# EAGLE design ItsyBitsy_Keybow_04 (EAGLE 9.5.2)
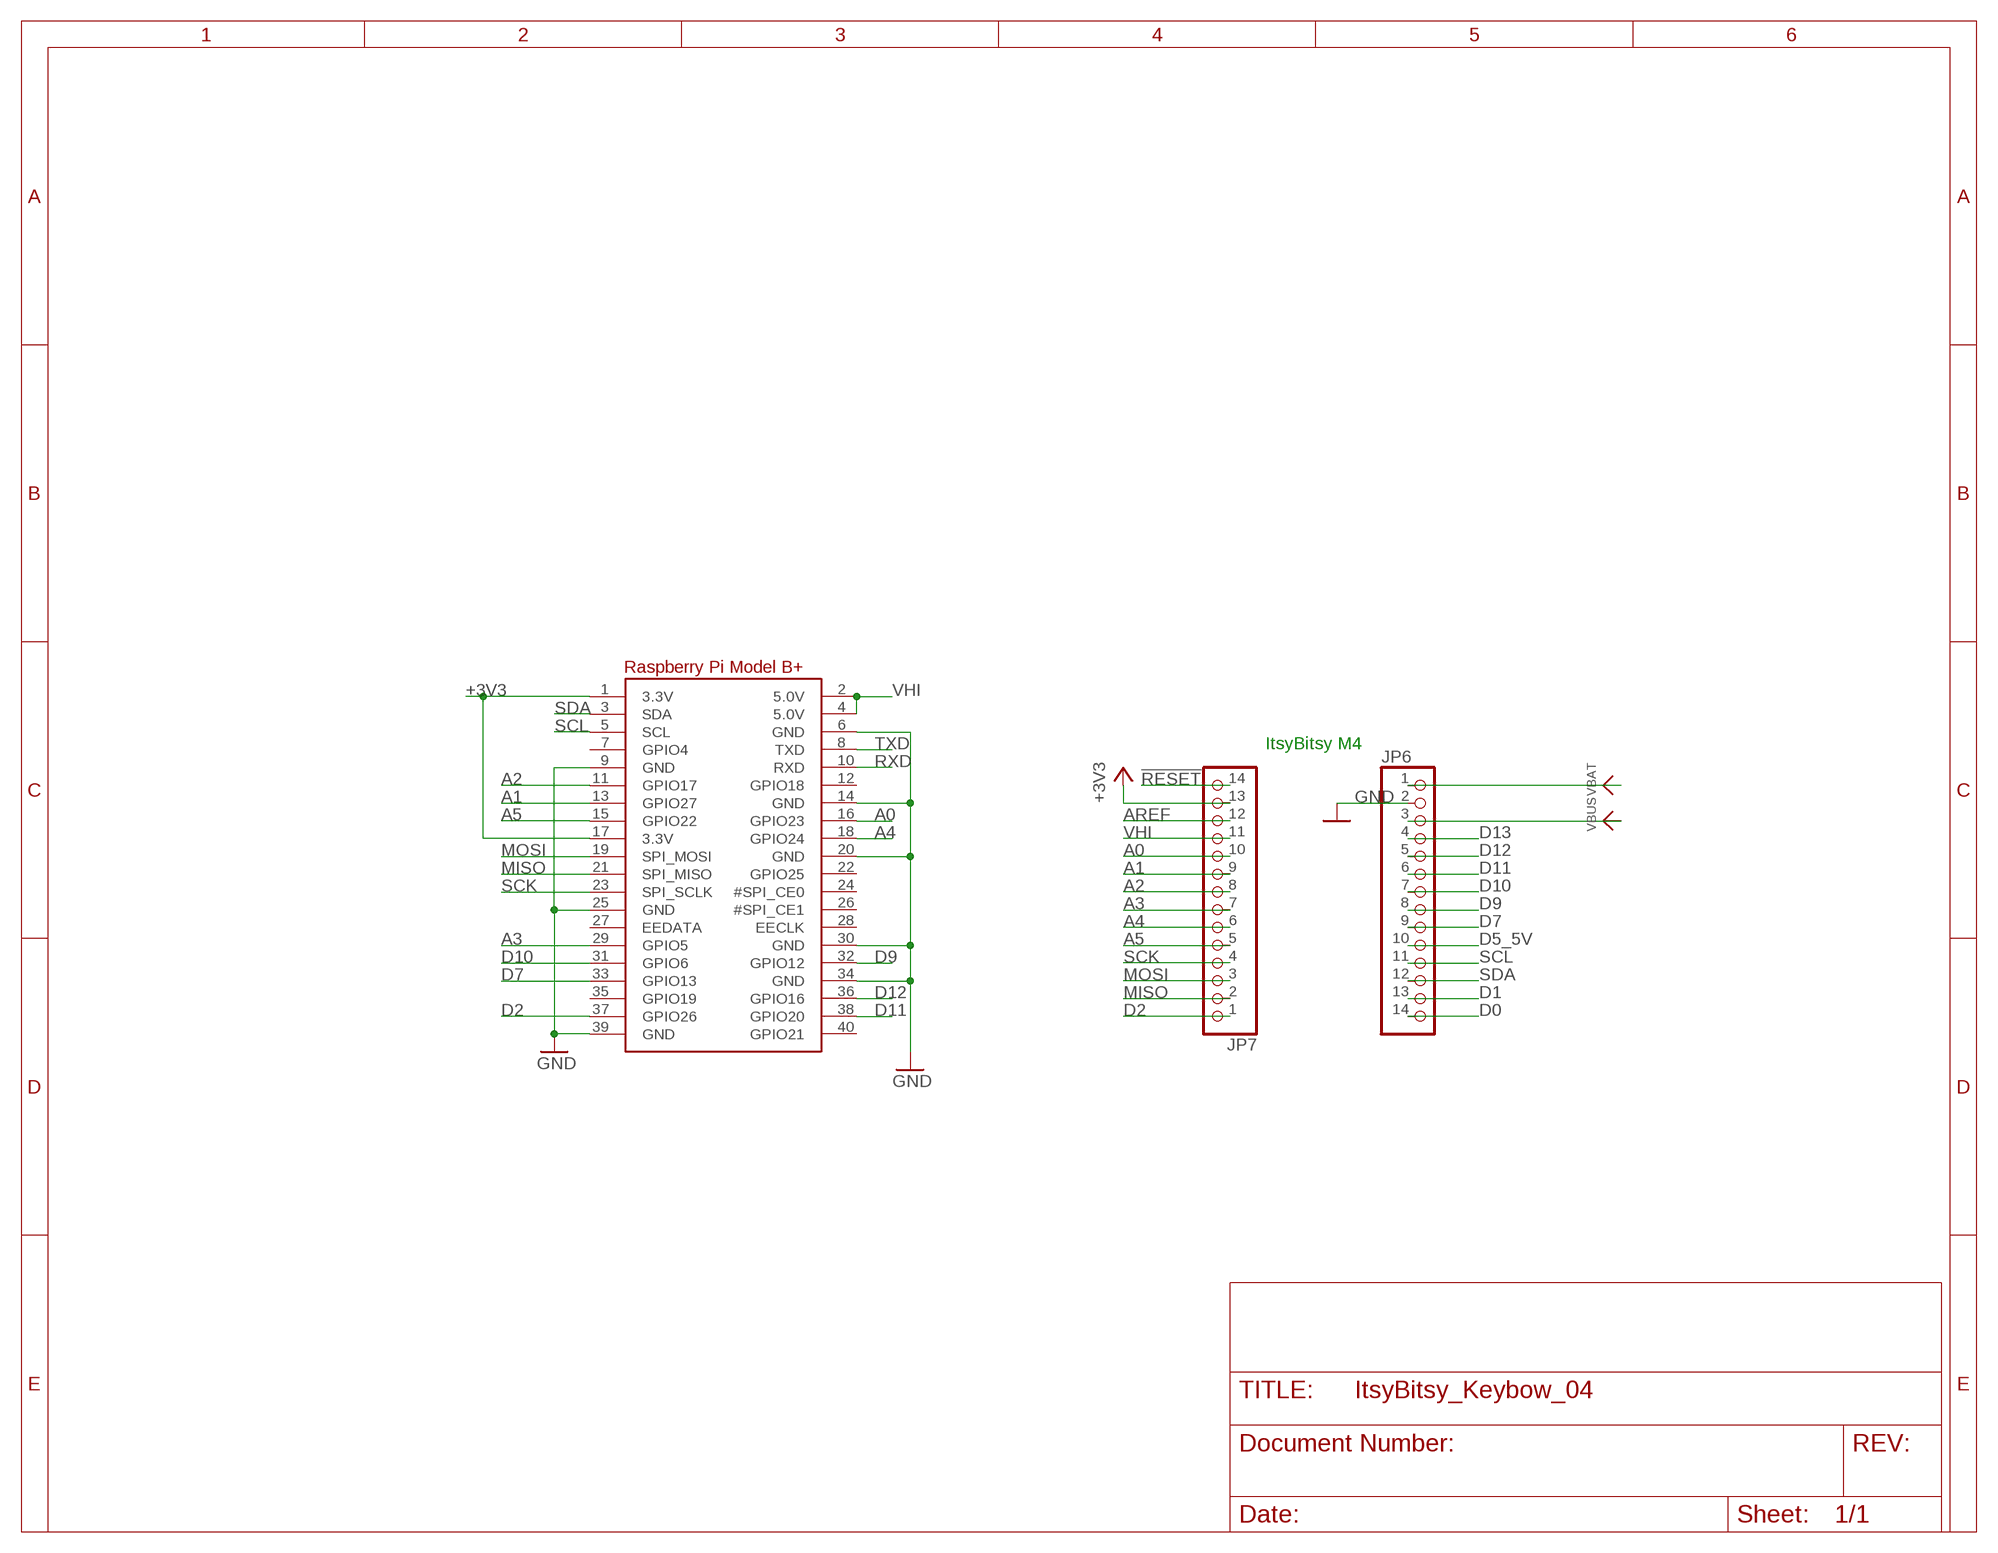
[diagram p0: schematic, sheet 1]

## Parts
JP6  HEADER-1X14  [1X14_ROUND70]
JP7  HEADER-1X14  [1X14_ROUND70]
RPI1  RASPBERRYPI_BPLUS_BONNETNODIM  [PI_BONNET_NODIM]

## Nets
!RESET: JP7.14
+3V3: JP7.13 RPI1.1(3.3V) RPI1.17(3.3V)
A0: JP7.10 RPI1.16(GPIO23)
A1: JP7.9 RPI1.13(GPIO27)
A2: JP7.8 RPI1.11(GPIO17)
A3: JP7.7 RPI1.29(GPIO5)
A4: JP7.6 RPI1.18(GPIO24)
A5: JP7.5 RPI1.15(GPIO22)
AREF: JP7.12
D0: JP6.14
D1: JP6.13
D2: JP7.1 RPI1.37(GPIO26)
D5_5V: JP6.10
D7: JP6.9 RPI1.33(GPIO13)
D9: JP6.8 RPI1.32(GPIO12)
D10: JP6.7 RPI1.31(GPIO6)
D11: JP6.6 RPI1.38(GPIO20)
D12: JP6.5 RPI1.36(GPIO16)
D13: JP6.4
GND: JP6.2 RPI1.6(GND) RPI1.9(GND) RPI1.14(GND) RPI1.20(GND) RPI1.25(GND) RPI1.30(GND) RPI1.34(GND) RPI1.39(GND)
MISO: JP7.2 RPI1.21(SPI_MISO)
MOSI: JP7.3 RPI1.19(SPI_MOSI)
RXD: RPI1.10(RXD)
SCK: JP7.4 RPI1.23(SPI_SCLK)
SCL: JP6.11 RPI1.5(SCL)
SDA: JP6.12 RPI1.3(SDA)
TXD: RPI1.8(TXD)
VBAT: JP6.1
VBUS: JP6.3
VHI: JP7.11 RPI1.2(5.0V) RPI1.4(5.0V)
Unconnected: RPI1.7(GPIO4) RPI1.12(GPIO18) RPI1.22(GPIO25) RPI1.24(#SPI_CE0) RPI1.26(#SPI_CE1) RPI1.27(EEDATA) RPI1.28(EECLK) RPI1.35(GPIO19) RPI1.40(GPIO21)

## Notes on the sheet
- ItsyBitsy M4

## Library data of the parts
JP6 JP7 = microbuilder:HEADER-1X14
RPI1 = microbuilder:RASPBERRYPI_BPLUS

## Board
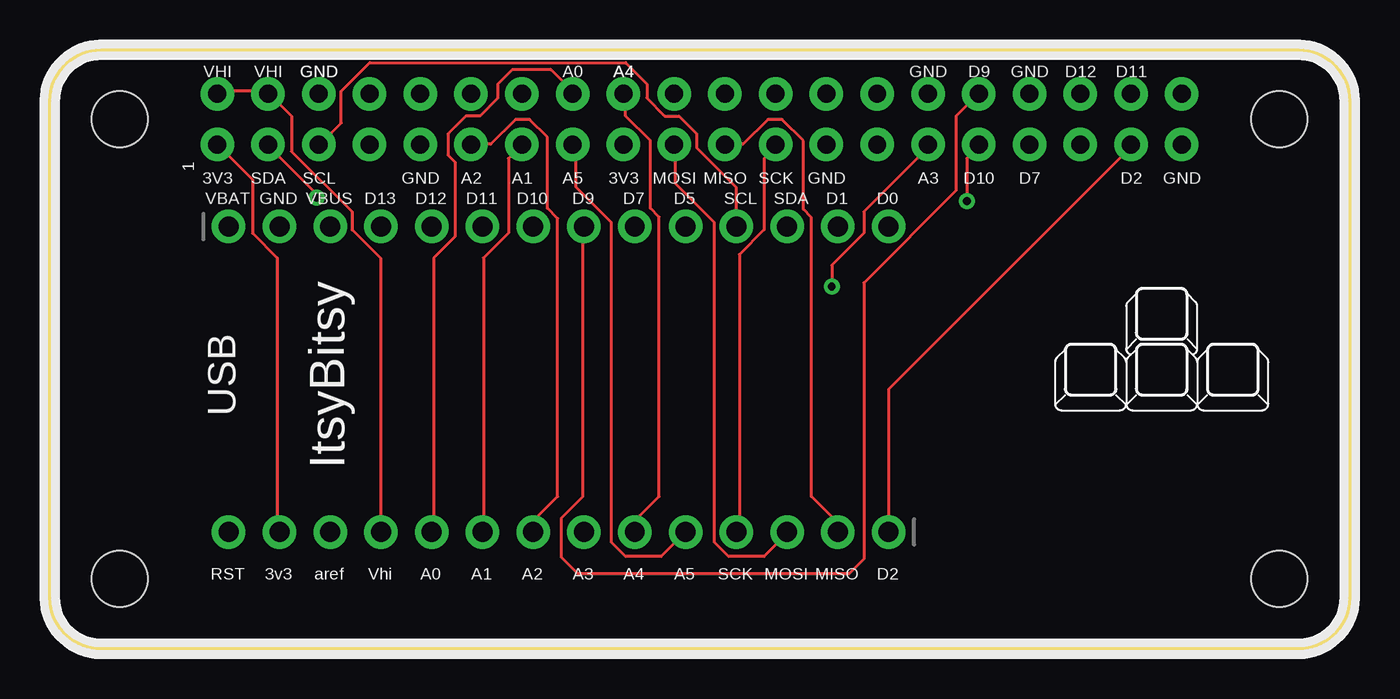
[diagram p1: board, top side]
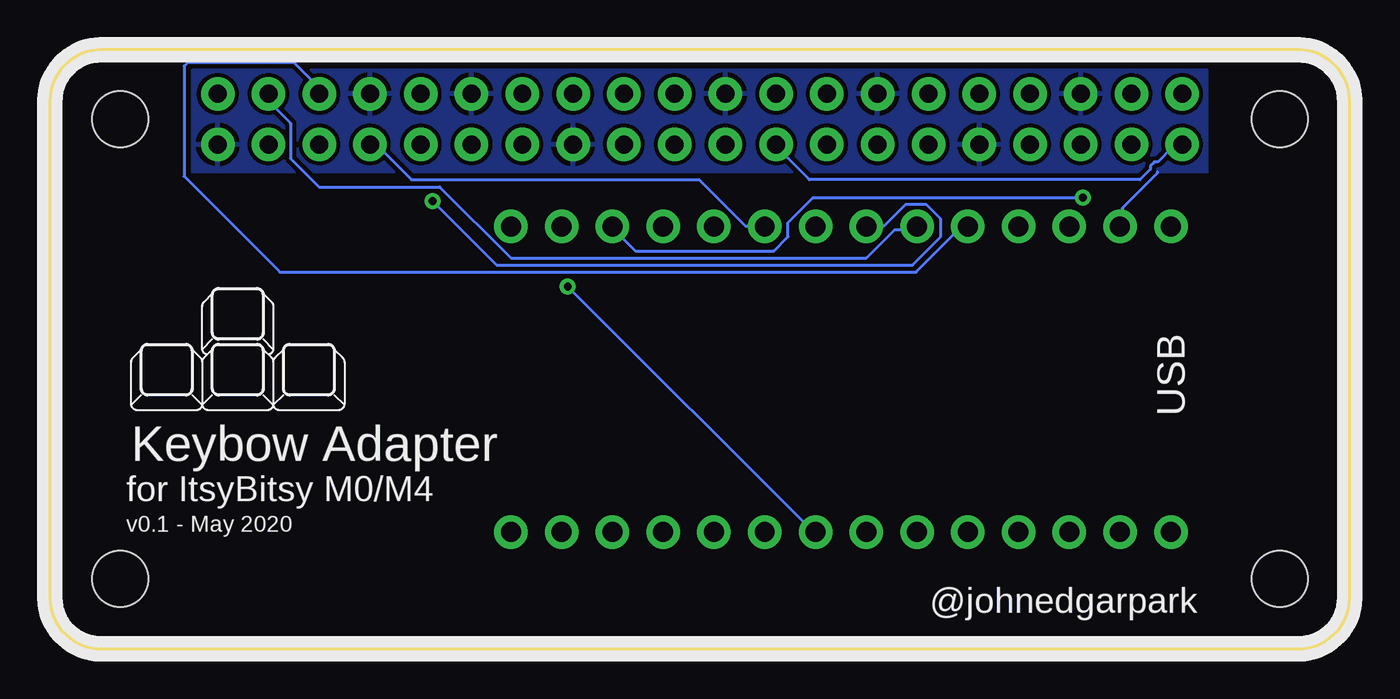
[diagram p2: board, bottom side, seen from below]

Size 65.02 x 29.97 mm. Coordinates in mm from the lower left corner, seen from the top.
Outline: 2.54,29.97 62.48,29.97 arc-90 65.02,27.43 65.02,2.54 arc-90 62.48,0 2.54,0 arc-90 0,2.54 0,27.43 arc-90 2.54,29.97
Copper layers (1*16): Top 0.035mm / dielectric 1.5mm / Bottom 0.035mm
Design rules "adafruit 7-7": minimum track width 6mil, minimum drill 15.5mil, track to track 8mil, track to pad 7mil, pad to pad 7mil, via to via 7mil, smd to smd 7mil, copper to edge 10mil, drill to drill 8mil, minimum pad ring 10mil, minimum via ring 8mil, stop-mask expansion 2mil, vias tented up to drill 20mil, thermal gap 10mil

### Footprints (pad centres in the part's own frame; a part is rotated, then mirrored left to right if it is on the bottom)
1X14_ROUND70 = drill 1 pad 1.676: 1 -16.51,0; 2 -13.97,0; 3 -11.43,0; 4 -8.89,0; 5 -6.35,0; 6 -3.81,0; 7 -1.27,0; 8 1.27,0; 9 3.81,0; 10 6.35,0; 11 8.89,0; 12 11.43,0; 13 13.97,0; 14 16.51,0
PI_BONNET_NODIM = drill 0.9 pad 1.676: 1 8.37,25.23; 2 8.37,27.77; 3 10.91,25.23; 4 10.91,27.77; 5 13.45,25.23; 6 13.45,27.77; 7 15.99,25.23; 8 15.99,27.77; 9 18.53,25.23; 10 18.53,27.77; 11 21.07,25.23; 12 21.07,27.77; 13 23.61,25.23; 14 23.61,27.77; 15 26.15,25.23; 16 26.15,27.77; 17 28.69,25.23; 18 28.69,27.77; 19 31.23,25.23; 20 31.23,27.77; 21 33.77,25.23; 22 33.77,27.77; 23 36.31,25.23; 24 36.31,27.77; 25 38.85,25.23; 26 38.85,27.77; 27 41.39,25.23; 28 41.39,27.77; 29 43.93,25.23; 30 43.93,27.77; 31 46.47,25.23; 32 46.47,27.77; 33 49.01,25.23; 34 49.01,27.77; 35 51.55,25.23; 36 51.55,27.77; 37 54.09,25.23; 38 54.09,27.77; 39 56.63,25.23; 40 56.63,27.77 | hole 2.8: 3.5,3.5; 3.5,26.5; 61.5,26.5; 61.5,3.5

### Placement (x,y rotation side)
JP6  25.45,21.13 0 top
JP7  25.45,5.84 180 top
RPI1  0,0.01 0 top

### Tracks (layer width: path | path; a pad name or v marks a point on that pad's centre or on a via)
+3V3
  Top 0.152: JP7.13 11.38,5.87 11.38,19.56 10.13,20.8 10.13,23.47 8.53,25.07 RPI1.1
  Bottom 0.152: RPI1.17 28.63,25.07 27.03,23.47 10.49,23.47 9.96,24 9.96,24.18 9.78,24.36 9.6,24.36 8.89,25.07 8.53,25.07 RPI1.1
A0
  Top 0.152: JP7.10 19.2,5.87 19.2,19.56 20.27,20.62 20.27,24.36 19.91,24.71 19.91,25.78 20.8,26.67 21.51,26.67 22.4,27.56 22.4,28.27 23.11,28.98 25.07,28.98 26.14,27.91 RPI1.16
A1
  Top 0.152: JP7.9 21.69,5.87 21.69,19.56 22.94,20.8 22.94,24.54 23.47,25.07 RPI1.13
A2
  Top 0.152: RPI1.11 21.16,25.25 22.05,25.25 23.29,26.49 24,26.49 24.89,25.6 24.89,22.05 25.4,21.54 25.4,7.62 24.18,6.4 JP7.8
A3  (via drill 0.39)
  Top 0.152: v39.12,18.14 39.12,19.2 40.72,20.8 40.72,21.87 43.92,25.07 RPI1.29
  Bottom 0.152: v39.12,18.14 26.85,5.87 JP7.7
A4
  Top 0.152: JP7.6 29.26,6.4 30.48,7.62 30.48,21.61 30.05,22.05 30.05,25.43 28.8,26.67 28.8,27.74 RPI1.18
A5
  Top 0.152: JP7.5 30.58,4.62 28.8,4.62 28.09,5.33 28.09,21.34 26.31,23.11 26.31,25.07 RPI1.15
D2
  Top 0.152: JP7.1 41.96,12.98 54.05,25.07 RPI1.37
D7
  Bottom 0.152: JP6.9 29.34,21.16 30.23,21.16 32.54,23.47 46.94,23.47 48.54,25.07 48.9,25.07 RPI1.33
D9
  Top 0.152: JP6.8 26.67,20.98 26.67,7.62 25.6,6.55 25.6,4.57 26.42,3.76 39.98,3.76 40.72,4.5 40.72,18.31 45.34,22.94 45.34,26.67 46.41,27.74 RPI1.32
D10  (via drill 0.39)
  Top 0.152: v45.87,22.4 45.87,24.54 46.41,25.07 RPI1.31
  Bottom 0.152: v45.87,22.4 42.67,19.2 21.87,19.2 20.45,20.62 20.45,21.51 21.16,22.23 22.23,22.23 23.29,21.16 24.18,21.16 JP6.7
D11
  Bottom 0.152: JP6.6 21.69,20.98 22.76,20.98 24.18,19.56 41.96,19.56 45.52,23.11 51.56,23.11 52.98,24.54 52.98,26.26 52.96,26.29 54.05,27.38 54.05,27.74 RPI1.38
D12
  Bottom 0.152: JP6.5 19.2,20.98 19.56,20.98 21.69,18.85 53.52,18.85 58.32,23.65 58.32,29.16 58.14,29.34 52.81,29.34 51.38,27.91 RPI1.36
GND
  Bottom 0.152: JP6.2 11.38,21.16 11.38,22.05 9.6,23.82 9.6,23.88
  pour Bottom: 7.11,28.96 57.91,28.96 57.91,23.88 7.11,23.88
MISO
  Top 0.152: JP7.2 39.42,6.3 38.1,7.62 38.1,21.59 37.69,22 37.69,25.43 36.63,26.49 35.92,26.49 34.67,25.25 33.78,25.25 RPI1.21
MOSI
  Top 0.152: RPI1.19 31.29,25.07 31.29,23.29 33.25,21.34 33.25,5.33 33.96,4.62 35.74,4.62 36.8,5.69 JP7.3
SCK
  Top 0.152: JP7.4 34.49,5.87 34.49,19.74 35.74,20.98 35.74,24.54 36.27,25.07 RPI1.23
SCL
  Top 0.152: JP6.11 34.31,21.16 34.31,23.11 32.36,25.07 32.36,25.78 31.47,26.67 30.76,26.67 29.87,27.56 29.87,28.27 28.8,29.34 16,29.34 14.58,27.91 14.58,26.31 13.51,25.25 RPI1.5
SDA  (via drill 0.39)
  Top 0.152: v13.34,22.58 13.34,22.76 11.02,25.07 RPI1.3
  Bottom 0.152: v13.34,22.58 26.85,22.58 28.09,21.34 28.09,20.62 28.8,19.91 35.74,19.91 36.8,20.98 JP6.12
VHI
  Top 0.152: RPI1.2 8.53,27.91 10.85,27.91 RPI1.4 11.02,27.74 12.09,26.67 12.09,24.89 15.11,21.87 15.11,20.98 16.54,19.56 16.54,5.87 JP7.11

### Text on the board
tNames: VHI | VHI | GND | GND | A0 | A4 | A4 | GND | D9 | GND | D12 | D11 | 1 | 3V3 | SDA | SCL | GND | A2 | A1 | A5 | 3V3 | MOSI | MISO | SCK | GND | A3 | D10 | D7 | D2 | GND | VBAT | GND | VBUS | D13 | D12 | D11 | D10 | D9 | D7 | D5 | SCL | SDA | D1 | D0 | USB | ItsyBitsy | RST | 3v3 | aref | Vhi | A0 | A1 | A2 | A3 | A4 | A5 | SCK | MOSI | MISO | D2
bNames: USB | Keybow Adapter | for ItsyBitsy M0/M4 | v0.1 - May 2020 | @johnedgarpark